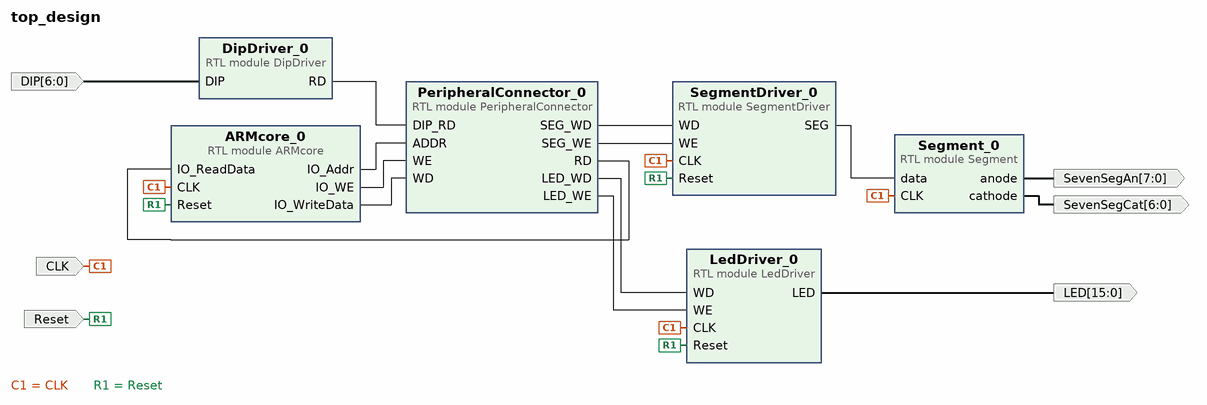
[diagram p0: block diagram of the top level]
# Vivado block design top_design, xc7a100tcsg324-3, Vivado 2021.2
create_bd_design top_design

create_bd_port -dir I -type clk CLK
set_property -dict {CONFIG.FREQ_HZ 100000000} [get_bd_ports CLK]
create_bd_port -dir I -type rst Reset
set_property -dict {CONFIG.POLARITY ACTIVE_HIGH} [get_bd_ports Reset]
create_bd_port -dir I -from 6 -to 0 DIP
create_bd_port -dir O -from 15 -to 0 LED
create_bd_port -dir O -from 7 -to 0 SevenSegAn
create_bd_port -dir O -from 6 -to 0 SevenSegCat

create_bd_cell -type module -reference Segment Segment_0
create_bd_cell -type module -reference PeripheralConnector PeripheralConnector_0
create_bd_cell -type module -reference LedDriver LedDriver_0
create_bd_cell -type module -reference SegmentDriver SegmentDriver_0
create_bd_cell -type module -reference DipDriver DipDriver_0
create_bd_cell -type module -reference ARMcore ARMcore_0

# ---- connections ----

connect_bd_net [get_bd_pins ARMcore_0/IO_Addr] [get_bd_pins PeripheralConnector_0/ADDR]
connect_bd_net [get_bd_pins ARMcore_0/IO_WE] [get_bd_pins PeripheralConnector_0/WE]
connect_bd_net [get_bd_pins ARMcore_0/IO_WriteData] [get_bd_pins PeripheralConnector_0/WD]
connect_bd_net [get_bd_ports CLK] \
  [get_bd_pins Segment_0/CLK] [get_bd_pins LedDriver_0/CLK] [get_bd_pins SegmentDriver_0/CLK] [get_bd_pins ARMcore_0/CLK]
connect_bd_net [get_bd_ports DIP] [get_bd_pins DipDriver_0/DIP]
connect_bd_net [get_bd_pins DipDriver_0/RD] [get_bd_pins PeripheralConnector_0/DIP_RD]
connect_bd_net [get_bd_pins LedDriver_0/LED] [get_bd_ports LED]
connect_bd_net [get_bd_pins PeripheralConnector_0/LED_WD] [get_bd_pins LedDriver_0/WD]
connect_bd_net [get_bd_pins PeripheralConnector_0/LED_WE] [get_bd_pins LedDriver_0/WE]
connect_bd_net [get_bd_pins PeripheralConnector_0/RD] [get_bd_pins ARMcore_0/IO_ReadData]
connect_bd_net [get_bd_pins PeripheralConnector_0/SEG_WD] [get_bd_pins SegmentDriver_0/WD]
connect_bd_net [get_bd_pins PeripheralConnector_0/SEG_WE] [get_bd_pins SegmentDriver_0/WE]
connect_bd_net [get_bd_ports Reset] [get_bd_pins LedDriver_0/Reset] [get_bd_pins SegmentDriver_0/Reset] [get_bd_pins ARMcore_0/Reset]
connect_bd_net [get_bd_pins SegmentDriver_0/SEG] [get_bd_pins Segment_0/data]
connect_bd_net [get_bd_pins Segment_0/anode] [get_bd_ports SevenSegAn]
connect_bd_net [get_bd_pins Segment_0/cathode] [get_bd_ports SevenSegCat]

validate_bd_design
save_bd_design
